# EasyEDA Pro project New Project_2025-08-05.eprj

# Schematic Schematic1
Board Name: Board1; Create Date: 2025-08-05; Page Name: P1; Project Name: New Project_2025-08-05; Schematic Name: Schematic1; Update Date: 2025-08-05; Company: 嘉立创EDA; Page Size: A4; Version: V1.0
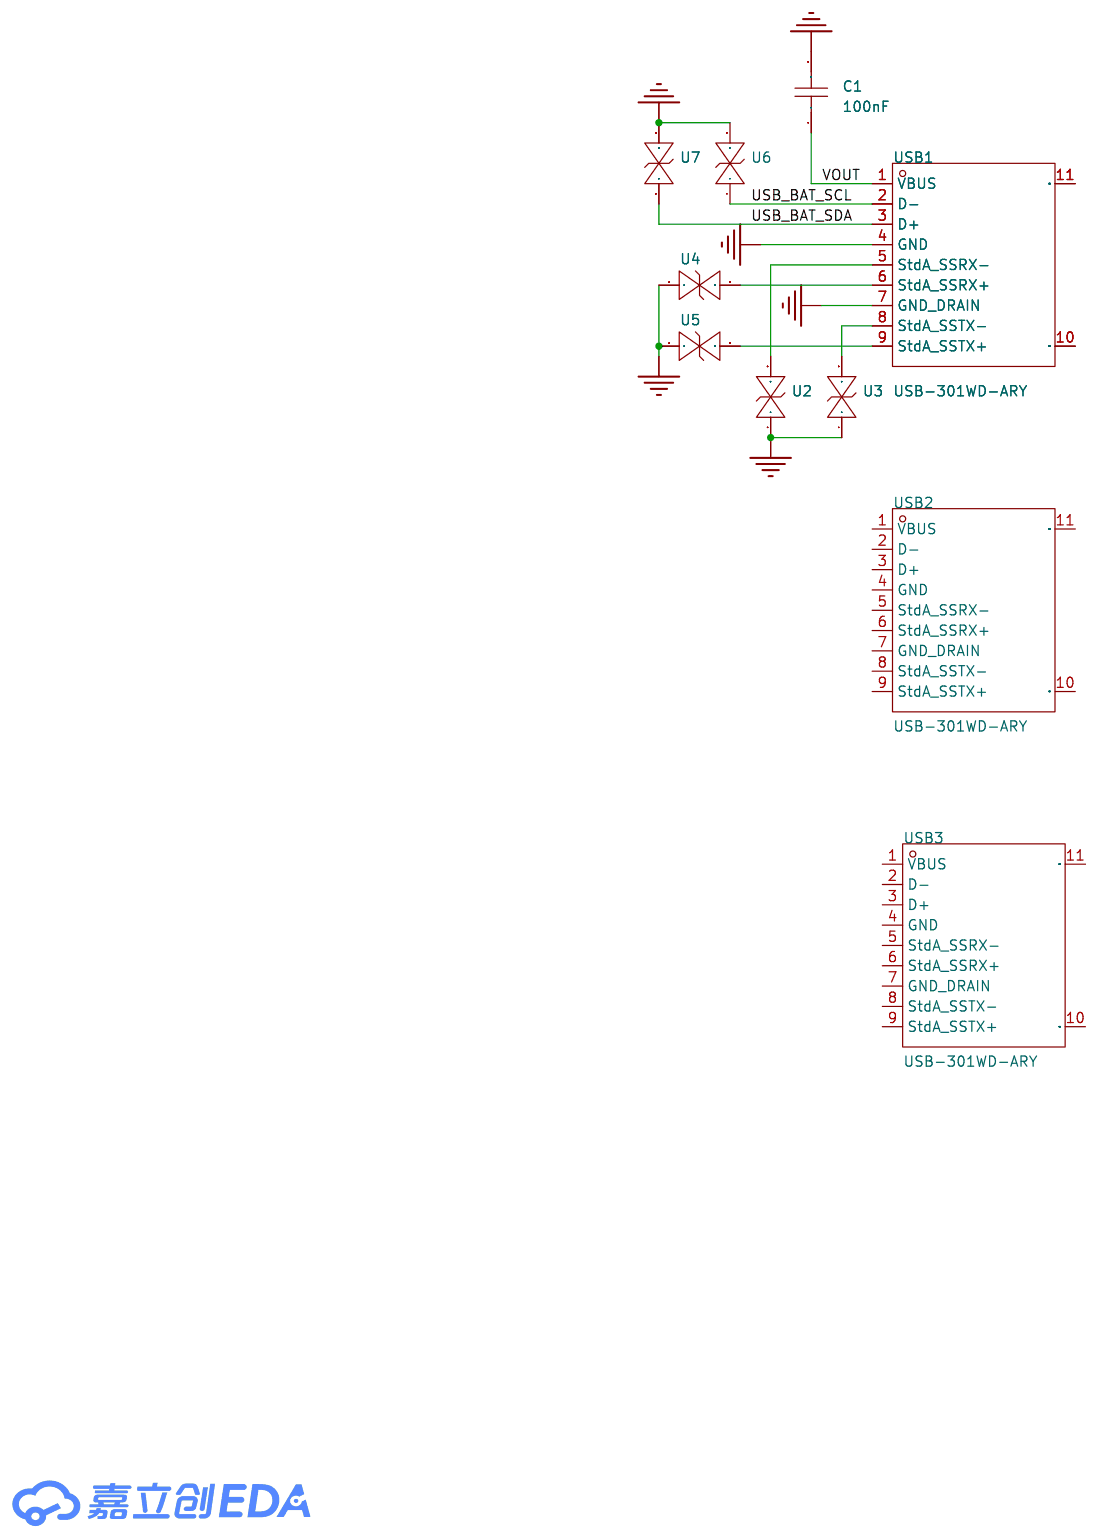
[diagram p0: schematic sheet]

## Parts
C1  100nF  [C0603]
U2  ESD5451N  [X1-DFN1006-2_L1.0-W0.6-P0.65-BI]
U3  ESD5451N  [X1-DFN1006-2_L1.0-W0.6-P0.65-BI]
U4  ESD5451N  [X1-DFN1006-2_L1.0-W0.6-P0.65-BI]
U5  ESD5451N  [X1-DFN1006-2_L1.0-W0.6-P0.65-BI]
U6  ESD5451N  [X1-DFN1006-2_L1.0-W0.6-P0.65-BI]
U7  ESD5451N  [X1-DFN1006-2_L1.0-W0.6-P0.65-BI]
USB1  USB-301WD-ARY  [USB-TH_XUNPU_USB-301WD-ARY]
USB2  USB-301WD-ARY  [USB-TH_XUNPU_USB-301WD-ARY]
USB3  USB-301WD-ARY  [USB-TH_XUNPU_USB-301WD-ARY]

## Library data of the parts
C1 = CAP_0603: Supplier Footprint: 0603
U2-U7 = ESD5451N_C2936977: LCSC Part Name: ESD二极管; Supplier Part: C2936977; Manufacturer: TECH PUBLIC(台舟); Supplier Footprint: DFN1006-2; JLCPCB Part Class: 扩展库; Datasheet: https://atta.szlcsc.com/upload/public/pdf/source/20211227/D040CF3F0222548C5BD9F7E690946783.pdf; Supplier: LCSC; Polarity: 双向; Reverse Stand-Off Voltage (Vrwm): 5V; Clamping Voltage: 13V; Peak Pulse Current (Ipp): 5.5A; Peak Pulse Power Dissipation (Ppp): 90W; Voltage - Breakdown: 8.4V; Reverse Leakage Current (Ir): 80nA; Number of Channels: 单路; Operating Temperature: -55℃~+125℃; level of protection: IEC 61000-4-2; Type: ESD
USB1-USB3 = USB-301WD-ARY: LCSC Part Name: Type-A 母 弯插; Supplier Part: C2895025; Manufacturer: XUNPU(讯普); Supplier Footprint: 插件; JLCPCB Part Class: 扩展库; Datasheet: https://atta.szlcsc.com/upload/public/pdf/source/20210908/6BA804621BB79CD49F2A1A281A5A9824.pdf; Supplier: LCSC; Connector Type: Type-A; Standard: USB 3.0; Gender: 母; Number of Ports: 1; Number of Contacts: 9P; Mounting Style: 弯插; Current Rating - Power (Max): 1.8A; Operating Temperature Range: -55℃~+85℃; Soldering Temperature(Max): 260℃

## Nets
GND: C1.2 U2.1 U3.1 U4.1 U5.1 U6.2 U7.2 USB1.4(GND) USB1.7(GND_DRAIN)
USB_BAT_SCL: U6.1 USB1.2(D-)
USB_BAT_SDA: U7.1 USB1.3(D+)
VOUT: C1.1 USB1.1(VBUS)
Net-(U2-2): U2.2 USB1.5(StdA_SSRX-)
Net-(U3-2): U3.2 USB1.8(StdA_SSTX-)
Net-(U4-2): U4.2 USB1.6(StdA_SSRX+)
Net-(U5-2): U5.2 USB1.9(StdA_SSTX+)

Not connected (* = marked no-connect by the designer): USB1 10(SHIELD) 11(SHIELD); USB2 1(VBUS) 2(D-) 3(D+) 4(GND) 5(StdA_SSRX-) 6(StdA_SSRX+) 7(GND_DRAIN) 8(StdA_SSTX-) 9(StdA_SSTX+) 10(SHIELD) 11(SHIELD); USB3 1(VBUS) 2(D-) 3(D+) 4(GND) 5(StdA_SSRX-) 6(StdA_SSRX+) 7(GND_DRAIN) 8(StdA_SSTX-) 9(StdA_SSTX+) 10(SHIELD) 11(SHIELD)
